# Altium schematic sheet Power.SchDoc: Top Level
size A3; CompanyName: NOT USED; DocumentNumber: 6; SheetNumber: 6; SheetTotal: 10; PageSetup: Record=PageOptions|CenterHorizontal=True|CenterVertical=True|PrintScale=1.00|XCorrection=1.00|YCorrection=1.00|PrintKind=0|BorderSize=5000000|LeftOffset=0|BottomOffset=0|Orientation=2|PaperLength=1000|PaperWidth=1000|Scale=100|PaperSource=7|PrintQuality=-4|MediaType=1|DitherType=10|PaperKind=A3|PrintScaleMode=0
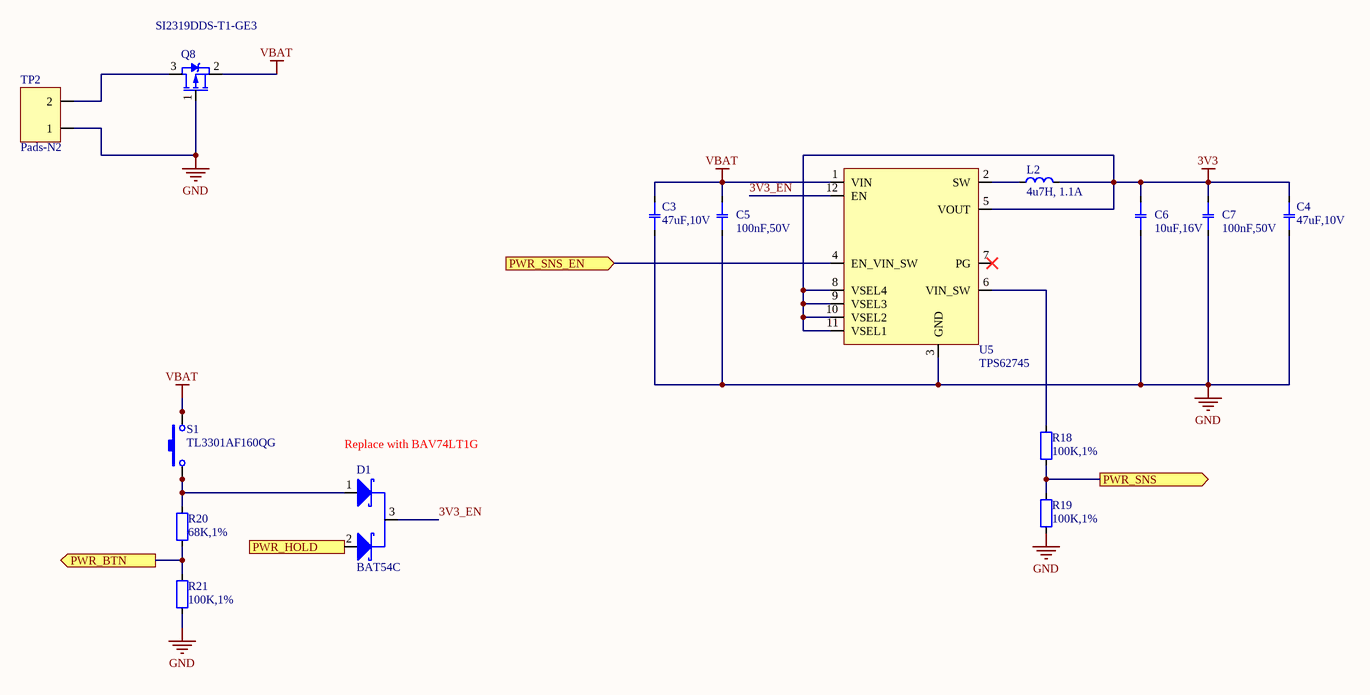
[diagram p0: Power.SchDoc]

## Parts
C3  47uF,10V  [CAPC2012X12N_0805]
C4  47uF,10V  [CAPC2012X12N_0805]
C5  100nF,50V  [CAPC1608X09N_0603]
C6  10uF,16V  [CAPC2012X12N_0805]
C7  100nF,50V  [CAPC1608X09N_0603]
D1  BAT54C  [SOT95P237X111-3N_SOT23]
L2  4u7H, 1.1A  [INDC2520X12N_1008]
Q8  SI2319DDS-T1-GE3  [SOT95P230X110-3N_SOT23]
R18  100K,1%  [RESC1608X06N_0603]
R19  100K,1%  [RESC1608X06N_0603]
R20  68K,1%  [RESC1608X06N_0603]
R21  100K,1%  [RESC1608X06N_0603]
S1  TL3301AF160QG  [SW_TL3301AFXXXXG]
TP2  Pads-N2  [PADS-N2]
U5  TPS62745  [R-PWSON-N12]

## Ports
PWR_BTN (out), PWR_HOLD (in), PWR_SNS (out), PWR_SNS_EN (in)

## Nets
3V3: C4.1 C6.2 C7.2 L2.2 U5.5(VOUT) U5.8(VSEL4) U5.9(VSEL3) U5.10(VSEL2) U5.11(VSEL1)
GND: C3.2 C4.2 C5.1 C6.1 C7.1 Q8.1(G) R19.1 R21.2 TP2.1 U5.3(GND)
VBAT: C3.1 C5.2 Q8.2(S) S1.3 S1.4 U5.1(VIN)
3V3_EN: D1.3(C1/C2) U5.12(EN)
PWR_BTN: R20.1 R21.1 ; port PWR_BTN
PWR_HOLD: D1.2(A2) ; port PWR_HOLD
PWR_SNS: R18.1 R19.2 ; port PWR_SNS
PWR_SNS_EN: U5.4(EN_VIN_SW) ; port PWR_SNS_EN
NetD1_1: D1.1(A1) R20.2 S1.1 S1.2
NetL2_1: L2.1 U5.2(SW)
NetQ8_3: Q8.3(D) TP2.2
NetR18_2: R18.2 U5.6(VIN_SW)

Not connected (* = marked no-connect by the designer): U5 7(PG)*

## Notes on the sheet
- (near D1) Replace with BAV74LT1G
- Project
- Size:
- Date:
- A3
- Revision:
- Sheet
- of
- Lambo
- File:

## Library data of the parts
C3 C4 = CCI-476DD-H: CAP CER 47UF 10V 20% X5R 0805; Manufacturer: TDK Corporation; Manufacturer Part Number: C2012X5R1A476M125AC; Type: Ceramic; Display_Name: 47uF,10V; Capacitance: 47uF; Dielectric: X5R; Tolerance: 20%; Voltage: 10V; BWA PN: CCI-476DD-H; Schematic Symbol: CAP-NP_1; Supplier 1: Digi-Key; Supplier Part Number 1: 445-8239-1-ND
C5 C7 = CCH-104CH-G: CAP CER 0.1UF 50V 10% X7R 0603; Manufacturer: Kemet; Manufacturer Part Number: C0603C104K5RACTU; Type: Ceramic; Display_Name: 100nF,50V; Capacitance: 100nF; Dielectric: X7R; Tolerance: 10%; Voltage: 50V; BWA PN: CCH-104CH-G; Schematic Symbol: CAP-NP_1; Supplier 1: Digi-Key; Supplier Part Number 1: 399-5089-1-ND
C6 = CCI-106CD-G: CAP CER 10µF ±10% 16V X7R 0805; Manufacturer: Samsung Electro-Mechanics America, Inc.; Manufacturer Part Number: CL21B106KOQNNNG; Type: Ceramic; Display_Name: 10uF,16V; Capacitance: 10uF; Dielectric: X7R; Tolerance: 10%; Voltage: 16V; BWA PN: CCI-106CD-G; Schematic Symbol: CAP-NP_1; Supplier 1: Digi-Key; Supplier Part Number 1: 1276-6472-1-ND
D1 = DIO-10192-A: DIODE ARRAY SCHOTTKY 30V SOT23-3; Manufacturer: Fairchild/ON Semiconductor; Vf@I: 800mV @ 100mA; d_if(max): 200mA; Display_Name: BAT54C; Type: Schottky; BWA PN: DIO-10192-A; Vr(max): 30V; Schematic Symbol: BAT54C; Manufacturer Part Number: BAT54C; Supplier 1: Digi-Key; Supplier Part Number 1: BAT54CFSCT-ND
L2 = IND-10165-A: INDUCTOR POWER 4.7UH 1.1A SMD; Manufacturer: Murata Electronics North America; Manufacturer Part Number: DFE252010R-H-4R7M=P2; Sheilding: Unsheilded; Type: Wirewound; DC Resistance: 276mOhm; Display_Name: 4u7H, 1.1A; Inductance: 4u7H; BWA PN: IND-10165-A; Current Rating: 1.1A; Schematic Symbol: INDUCTOR_1; Supplier 1: Digi-Key; Supplier Part Number 1: 490-10646-1-ND
Q8 = TRN-10117-A: MOSFET P-CHAN 40V; Manufacturer: Vishay Siliconix; Type: P; Id(max): 2.7A (Ta), 3.6A (Tc); rds(on): 75mOhm @ 2.7A, 10V; Vgs(max): ±20V; Vth(max): 2.5V @ 250µA; Display_Name: SI2319DDS-T1-GE3; BWA PN: TRN-10117-A; Vds(max): 40V; Schematic Symbol: MOSFET-P_1; Manufacturer Part Number: SI2319DDS-T1-GE3; Supplier 1: Digi-Key; Supplier Part Number 1: SI2319DDS-T1-GE3CT-ND
R18 R19 R21 = RSH-100K0-D: RES 100K OHM 1/10W 1% 0603 SMD; Manufacturer: Yageo; Manufacturer Part Number: RC0603FR-07100KL; Power: 0.1W; Display_Name: 100K,1%; Resistance: 100K; Tolerance: 1%; Type: Chip; BWA PN: RSH-100K0-D; Schematic Symbol: RESISTOR_1; Supplier 1: Digi-Key; Supplier Part Number 1: 311-100KHRCT-ND
R20 = RSH-68K00-D: RES 68K OHM 1/10W 1% 0603 SMD; Manufacturer: Yageo; Manufacturer Part Number: RC0603FR-0768KL; Power: 0.1W; Display_Name: 68K,1%; Resistance: 68K; Tolerance: 1%; Type: Chip; BWA PN: RSH-68K00-D; Schematic Symbol: RESISTOR_1; Supplier 1: Digi-Key; Supplier Part Number 1: 311-68.0KHRCT-ND
S1 = SWT-10009-A: SWITCH TACT 160GF H=5.0MM SMT; Manufacturer: E-Switch; Circuit: SPST-NO; Function: Off-Mom; Display_Name: TL3301AF160QG; Type: Tactile; BWA PN: SWT-10009-A; Schematic Symbol: SW_SPST_2; Manufacturer Part Number: TL3301AF160QG; Supplier 1: Digi-Key; Supplier Part Number 1: EG2526CT-ND
U5 = ICT-10699-A: Step Down Converter; Manufacturer: Texas Instruments; Temp Range: -40°C ~ 85°C; Display_Name: TPS62745; BWA PN: ICT-10699-A; Schematic Symbol: TPS62745; Manufacturer Part Number: TPS62745; Supplier 1: Digi-Key; Supplier Part Number 1: 296-44339-1-ND; Supplier 2: Element 14; Supplier Part Number 2: 2498474